# EasyEDA Pro project ProPrj_RPI5 tinkling_2026-08-20.epro

# Schematic Schematic1
Board Name: Board1; Create Date: 2026-06-21; Page Name: P1; Project Name: RPI5 tinkling; Schematic Name: Schematic1; Update Date: 2026-07-21; Company: EasyEDA.com; Page Size: A4; Version: V1.0
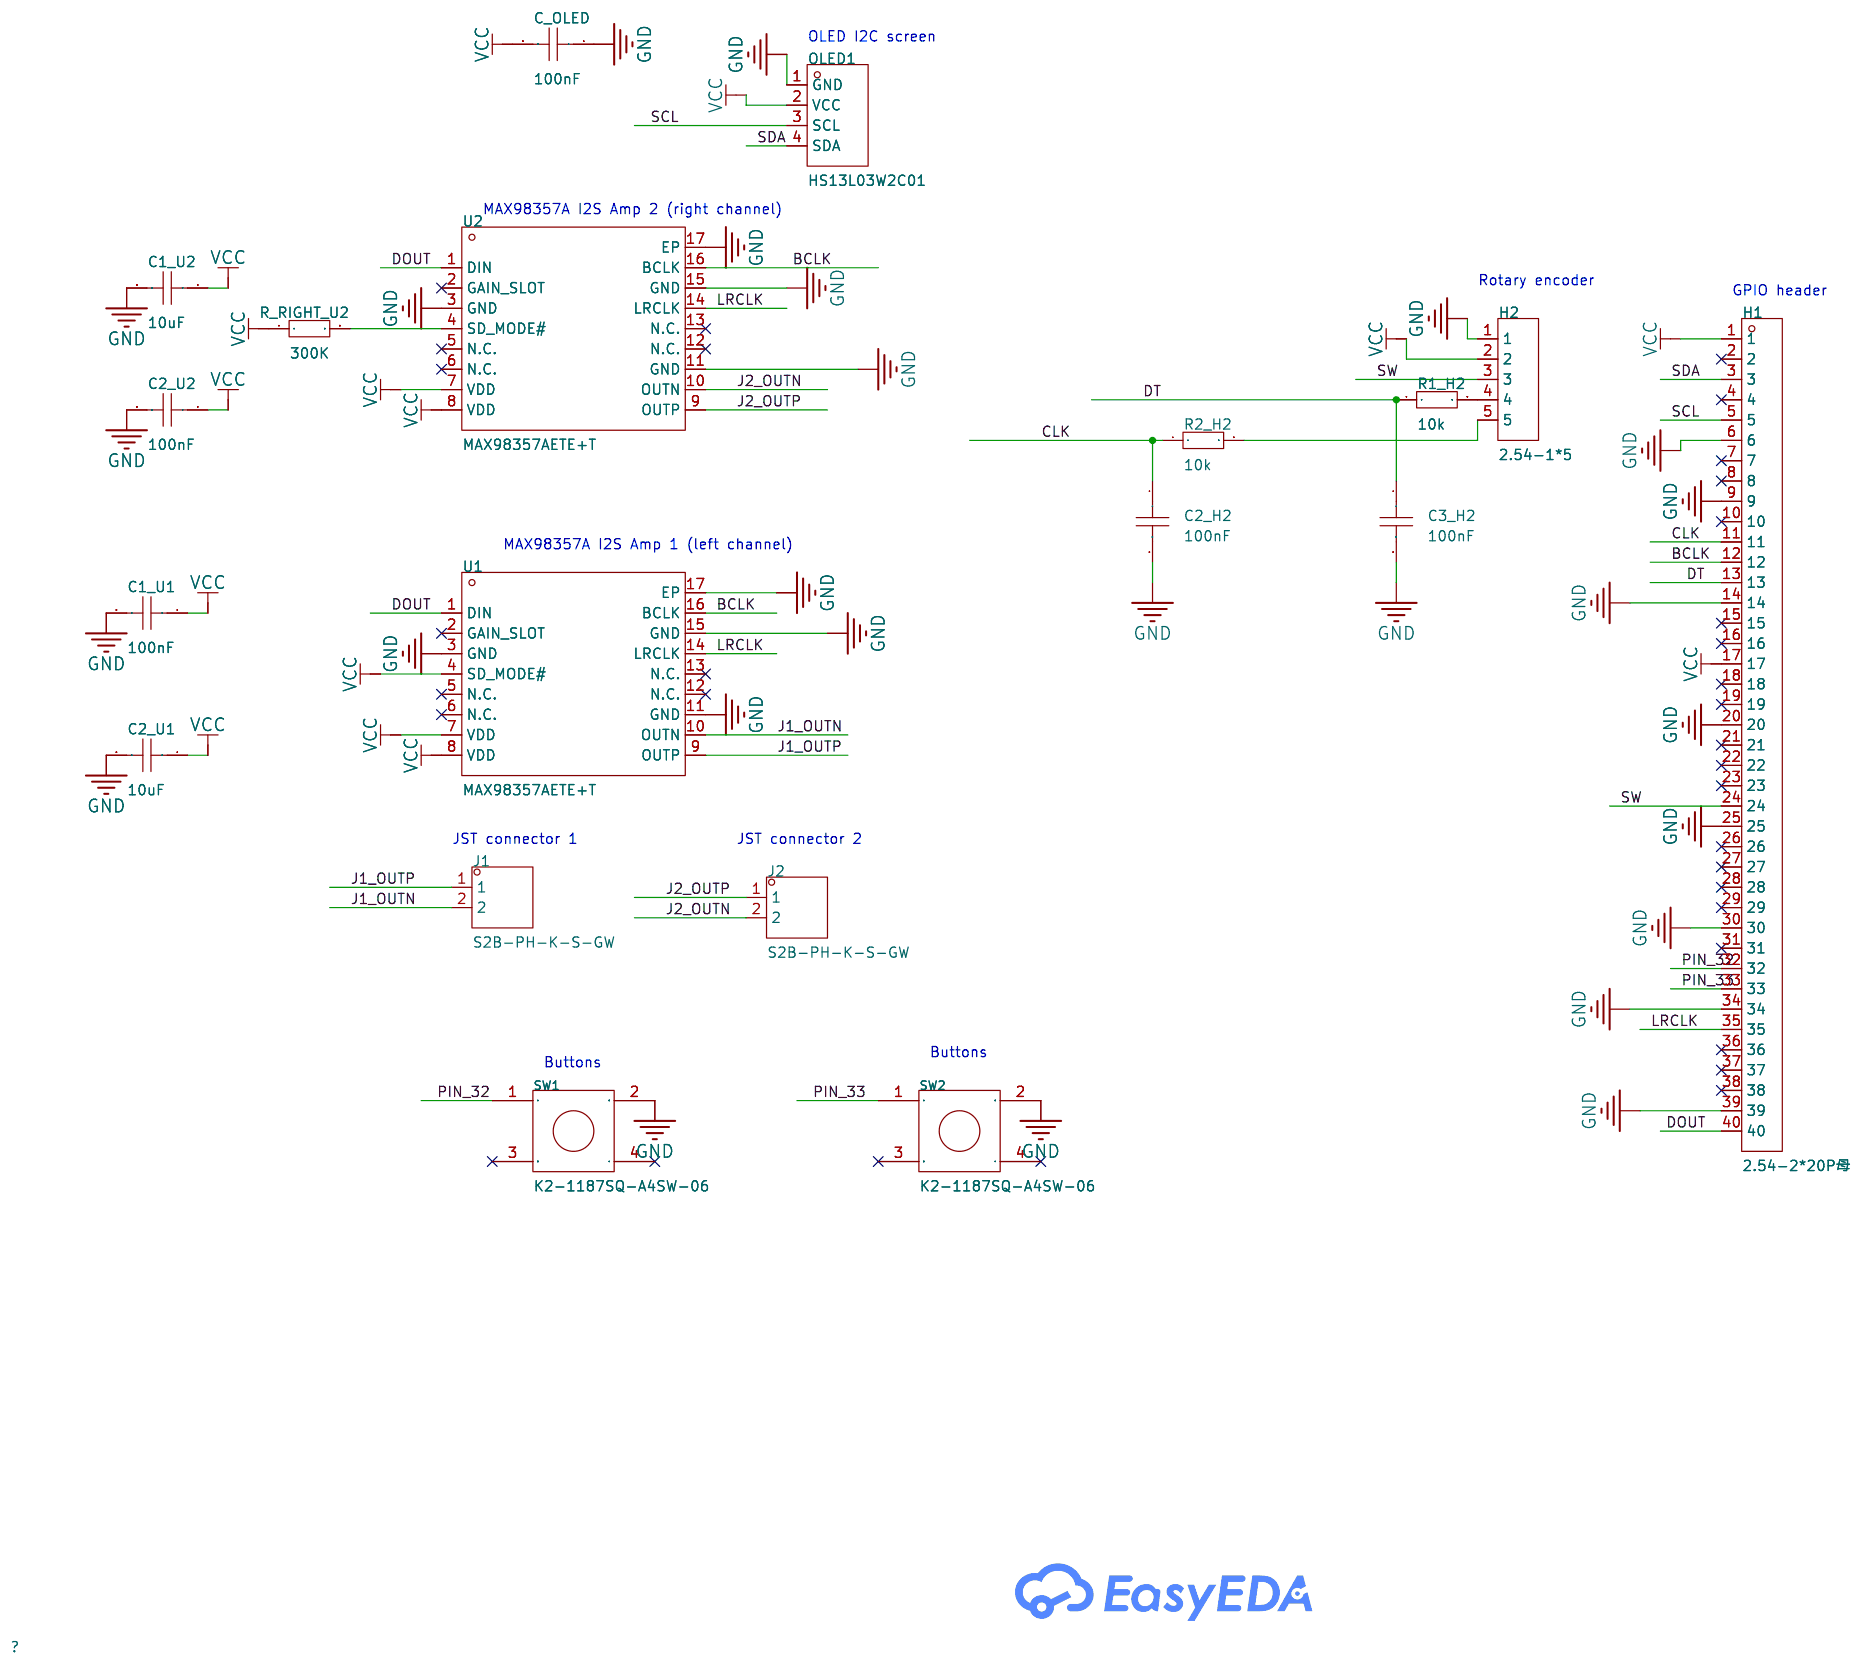
[diagram p0: schematic sheet]

## Parts
C1_U1  100nF  [C0402]
C1_U2  10uF  [C0805]
C2_H2  100nF  [C0603]
C2_U1  10uF  [C0805]
C2_U2  100nF  [C0402]
C3_H2  100nF  [C0603]
C_OLED  100nF  [C0603]
H1  2.54-2*20P母  [HDR-TH_40P-P2.54-V-F-R2-C20-S2.54]  (no BOM)
H2  2.54-1*5  [HDR-TH_5P-P2.54-V-M]  (no BOM)
J1  S2B-PH-K-S-GW  [CONN-TH_S2B-PH-K-S-GW]
J2  S2B-PH-K-S-GW  [CONN-TH_S2B-PH-K-S-GW]
OLED1  HS13L03W2C01  [OLED-TH_L35.4-W33.5_HS13L03W2C01]  (no BOM)
R1_H2  10k  [R0603]
R2_H2  10k  [R0603]
R_RIGHT_U2  300K  [R0603]
SW1  K2-1187SQ-A4SW-06  [KEY-SMD_4P-L5.2-W5.2-P3.70-LS6.4]
SW2  K2-1187SQ-A4SW-06  [KEY-SMD_4P-L5.2-W5.2-P3.70-LS6.4]
U1  MAX98357AETE+T  [TQFN-16_L3.0-W3.0-P0.50-BL-EP1.5]
U2  MAX98357AETE+T  [TQFN-16_L3.0-W3.0-P0.50-BL-EP1.5]

## Library data of the parts
C1_U1 C2_U2 = CL05B104KO5NNNC: Capacitance:100nF Tolerance:±10% Tolerance:±10% Voltage Rating:16V Temperature Coefficient:X7R; LCSC Part Name: 100nF ±10% 16V; Supplier Part: C1525; Manufacturer: SAMSUNG(三星); Supplier Footprint: 0402; JLCPCB Part Class: Basic Part; Datasheet: https://item.szlcsc.com/datasheet/CL05B104KO5NNNC/1877.html; Supplier: LCSC; Tolerance: ±10%; Voltage Rating: 16V; Temperature Coefficient: X7R
C1_U2 C2_U1 = CL21A106KAYNNNE_C15850: Capacitance:10uF Tolerance:±10% Tolerance:±10% Voltage Rating:25V Temperature Coefficient:X5R; LCSC Part Name: 10uF ±10% 25V; Supplier Part: C15850; Manufacturer: SAMSUNG(三星); Manufacturer Part: CL21A106KAYNNNE; Supplier Footprint: 0805; JLCPCB Part Class: Basic Part; Datasheet: https://item.szlcsc.com/datasheet/CL21A106KAYNNNE/16532.html; Supplier: LCSC; Tolerance: ±10%; Voltage Rating: 25V; Temperature Coefficient: X5R
C2_H2 C3_H2 C_OLED = CL10B104KA8NNNC: Capacitance:100nF Tolerance:±10% Tolerance:±10% Voltage Rating:25V Temperature Coefficient:X7R; LCSC Part Name: 100nF ±10% 25V; Supplier Part: C1590; Manufacturer: SAMSUNG(三星); Supplier Footprint: 0603; JLCPCB Part Class: Extended Part; Datasheet: https://item.szlcsc.com/datasheet/CL10B104KA8NNNC/1942.html; Supplier: LCSC; Tolerance: ±10%; Voltage Rating: 25V; Temperature Coefficient: X7R
H1 = 2.54-2*20P母: Holes Structure:2x20P Pitch:2.54mm Row Spacing:2.54mm Circular Hole / Square Hole:Square Hole Mounting Type:Through Hole Number of Rows:2 Number of Positions:40P Holes Direction:Top Insulation Height:- Contact Material:Brass Contact Plating:-; LCSC Part Name: 2x20P 间距:2.54mm 直插; Supplier Part: C50982; Manufacturer: BOOMELE(博穆精密); Supplier Footprint: 插件,P=2.54mm; JLCPCB Part Class: Extended Part; Supplier: LCSC; Holes Structure: 2x20P; Pitch: 2.54mm; Row Spacing: 2.54mm; Circular Hole / Square Hole: Square Hole; Mounting Type: Through Hole; Number of Rows: 2; Number of Positions: 40P; Holes Direction: Top; Contact Material: Brass
H2 = 2.54-1*5: Pin Structure:1x5P Pitch:2.54mm Circluar Pins/Square Pins:Pin Header Mounting Type:Through Hole Number of Rows:1 Number of Pins:5P Current Rating:2.5A Length of Mating Pin:6mm Insulation Height:2.54mm Length of End Connection Pin:3mm Contact Material:Bras; LCSC Part Name: 1x5P 间距:2.54mm 方针 直插; Supplier Part: C5156614; Manufacturer: ZHOURI(洲日); Supplier Footprint: 插件,P=2.54mm; JLCPCB Part Class: Extended Part; Datasheet: https://item.szlcsc.com/datasheet/2.54-1*5/5790714.html; Supplier: LCSC; Pin Structure: 1x5P; Pitch: 2.54mm; Circluar Pins/Square Pins: Pin Header; Mounting Type: Through Hole; Number of Rows: 1; Number of Pins: 5P; Current Rating: 2.5A; Length of Mating Pin: 6mm; Insulation Height: 2.54mm; Length of End Connection Pin: 3mm; Contact Material: Brass; Contact Plating: Gold; Operating Temperature: -40℃~+105℃
J1 J2 = S2B-PH-K-S-GW: Pins Structure:1x2P Pitch:2mm Mounting Type:Right Angle Reference Series:PH Number of Pins:2P Number of Rows:1 Number of PINs Per Row:2 Row Spacing:- Current Rating:2A Contact Material:Brass Contact Plating:Tin Operating Temperature:-25℃~+85℃ Operating Te; LCSC Part Name: 1x2P 间距:2mm 弯插 系列:PH; Supplier Part: C157932; Manufacturer: JST; Supplier Footprint: 弯插,P=2mm; JLCPCB Part Class: Extended Part; Datasheet: https://item.szlcsc.com/datasheet/S2B-PH-K-S-GW/169280.html; Supplier: LCSC; Pins Structure: 1x2P; Pitch: 2mm; Mounting Type: Right Angle; Reference Series: PH; Number of Pins: 2P; Number of Rows: 1; Number of PINs Per Row: 2; Current Rating: 2A; Contact Material: Brass; Contact Plating: Tin; Operating Temperature: -25℃~+85℃; Voltage Rating: 100V; Plastic Material: PA66; Flame Retardant Rating: UL94V-0; Supplementary Features: K Pin; Color: White; Z-Height of the Board: 4.8mm; X-Length of Bottom Edge on Board (Spacing Line): 5.9mm; Y-Width of Bottom Edge on Board: 7.6mm
OLED1 = HS13L03W2C01: Main Control Chip:SH1106 Interface Type:I2C Size:1.3 Operating Temperature:-40℃~+70℃ Operating Temperature:-40℃~+70℃; LCSC Part Name: 1.3'1.3寸 128*64 OLED显示屏 I2C通讯 SH1106 白光; Supplier Part: C7465997; Manufacturer: HS(汉昇); JLCPCB Part Class: Extended Part; Datasheet: https://atta.szlcsc.com/upload/public/pdf/source/20230720/8731A47396DED074CDCD72E9ACEFB46F.pdf; Supplier: LCSC; Main Control Chip: SH1106; Interface Type: I2C; Size: 1.3; Operating Temperature: -40℃~+70℃
R1_H2 R2_H2 R_RIGHT_U2 = Res_0603: Supplier Footprint: 0603
SW1 SW2 = K2-1187SQ-A4SW-06: Circuit:SPST Actuator Style:Round Button Operating Force:2.5N Mounting Type:Surface Mount,Vertical Length:5.2mm Width:5.2mm Switch Height:1.5mm Contact Current:50mA Voltage Rating:12V With Lamp:- Life:100,000 Cycles Operating Temperature:-25℃~+85℃ Operati; LCSC Part Name: 轻触开关 5.2*5.2*1.5  250gf  铜头; Supplier Part: C92584; Manufacturer: 韩国韩荣; Supplier Footprint: SMD; JLCPCB Part Class: Extended Part; Datasheet: https://item.szlcsc.com/datasheet/K2-1187SQ-A4SW-06/93777.html; Supplier: LCSC; Circuit: SPST; Actuator Style: Round Button; Operating Force: 2.5N; Mounting Type: Surface Mount,Vertical; Length: 5.2mm; Width: 5.2mm; Switch Height: 1.5mm; Contact Current: 50mA; Voltage Rating: 12V; Life: 100,000 Cycles; Operating Temperature: -25℃~+85℃
U1 U2 = MAX98357AETE+T: Class:Class D Speaker Channels:- Output Power:3.2W×1@4Ω Voltage - Supply:2.5V~5.5V Voltage - Supply:2.5V~5.5V Total Harmonic Distortion + Noise (THD+N):- Quiescent Current:2.4mA Operating Temperature:-40℃~+85℃ Operating Temperature:-40℃~+85℃ Power Supply; LCSC Part Name: 微型、低成本、PCM 类 D 级放大器具有 AB 级性能; Supplier Part: C910544; Manufacturer: ADI(亚德诺)/MAXIM(美信); Supplier Footprint: TQFN-16-EP(3x3); JLCPCB Part Class: Extended Part; Datasheet: https://item.szlcsc.com/datasheet/MAX98357AETE%252BT/978950.html; Supplier: LCSC; Class: Class D; Output Power: 3.2W×1@4Ω; Voltage - Supply: 2.5V~5.5V; Quiescent Current: 2.4mA; Operating Temperature: -40℃~+85℃; Power Supply Rejection Ratio (PSRR): 77dB; Efficiency: 92%

## Nets
GND: C1_U1.2 C1_U2.2 C2_H2.2 C2_U1.2 C2_U2.2 C3_H2.2 C_OLED.1 H1.6 H1.9 H1.14 H1.20 H1.25 H1.30 H1.34 H1.39 H2.1 OLED1.1(GND) SW1.2 SW2.2 U1.3(GND) U1.11(GND) U1.15(GND) U1.17(EP) U2.3(GND) U2.11(GND) U2.15(GND) U2.17(EP)
VCC: C1_U1.1 C1_U2.1 C2_U1.1 C2_U2.1 C_OLED.2 H1.1 H1.17 H2.2 OLED1.2(VCC) R_RIGHT_U2.1 U1.4(SD_MODE#) U1.7(VDD) U1.8(VDD) U2.7(VDD) U2.8(VDD)
BCLK: H1.12 U1.16(BCLK) U2.16(BCLK)
CLK: C2_H2.1 H1.11 R2_H2.1
DOUT: H1.40 U1.1(DIN) U2.1(DIN)
DT: C3_H2.1 H1.13 R1_H2.1
J1_OUTN: J1.2 U1.10(OUTN)
J1_OUTP: J1.1 U1.9(OUTP)
J2_OUTN: J2.2 U2.10(OUTN)
J2_OUTP: J2.1 U2.9(OUTP)
LRCLK: H1.35 U1.14(LRCLK) U2.14(LRCLK)
PIN_32: H1.32 SW1.1
PIN_33: H1.33 SW2.1
SCL: H1.5 OLED1.3(SCL)
SDA: H1.3 OLED1.4(SDA)
SW: H1.24 H2.3
$1N7016: H2.4 R1_H2.2
$1N7184: H2.5 R2_H2.2
Net-(R_RIGHT_U2-2): R_RIGHT_U2.2 U2.4(SD_MODE#)

Not connected (* = marked no-connect by the designer): H1 2* 4* 7* 8* 10* 15* 16* 18* 19* 21* 22* 23* 26* 27* 28* 29* 31* 36* 37* 38*; SW1 3* 4*; SW2 3* 4*; U1 2(GAIN_SLOT)* 5(N.C.)* 6(N.C.)* 12(N.C.)* 13(N.C.)*; U2 2(GAIN_SLOT)* 5(N.C.)* 6(N.C.)* 12(N.C.)* 13(N.C.)*

## Notes on the sheet
- OLED I2C screen
- MAX98357A I2S Amp 2 (right channel)
- Rotary encoder
- GPIO header
- MAX98357A I2S Amp 1 (left channel)
- JST connector 1
- JST connector 2
- Buttons
- Buttons

# Board PCB1
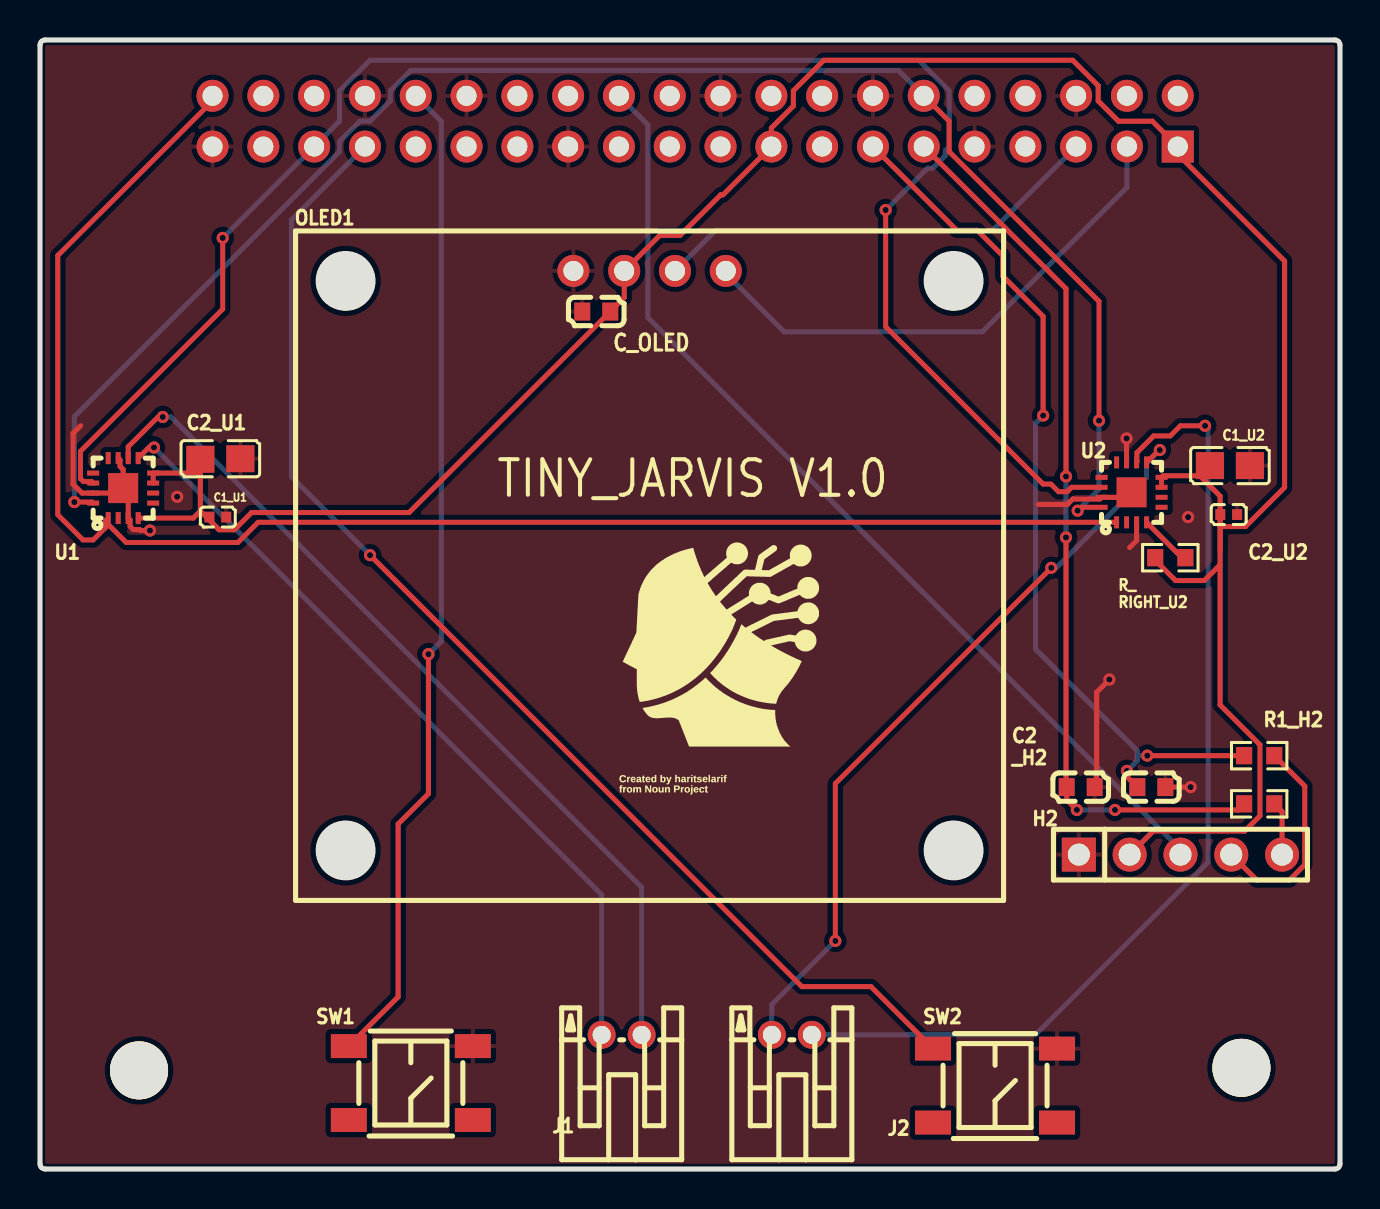
[diagram p1: board, top side]
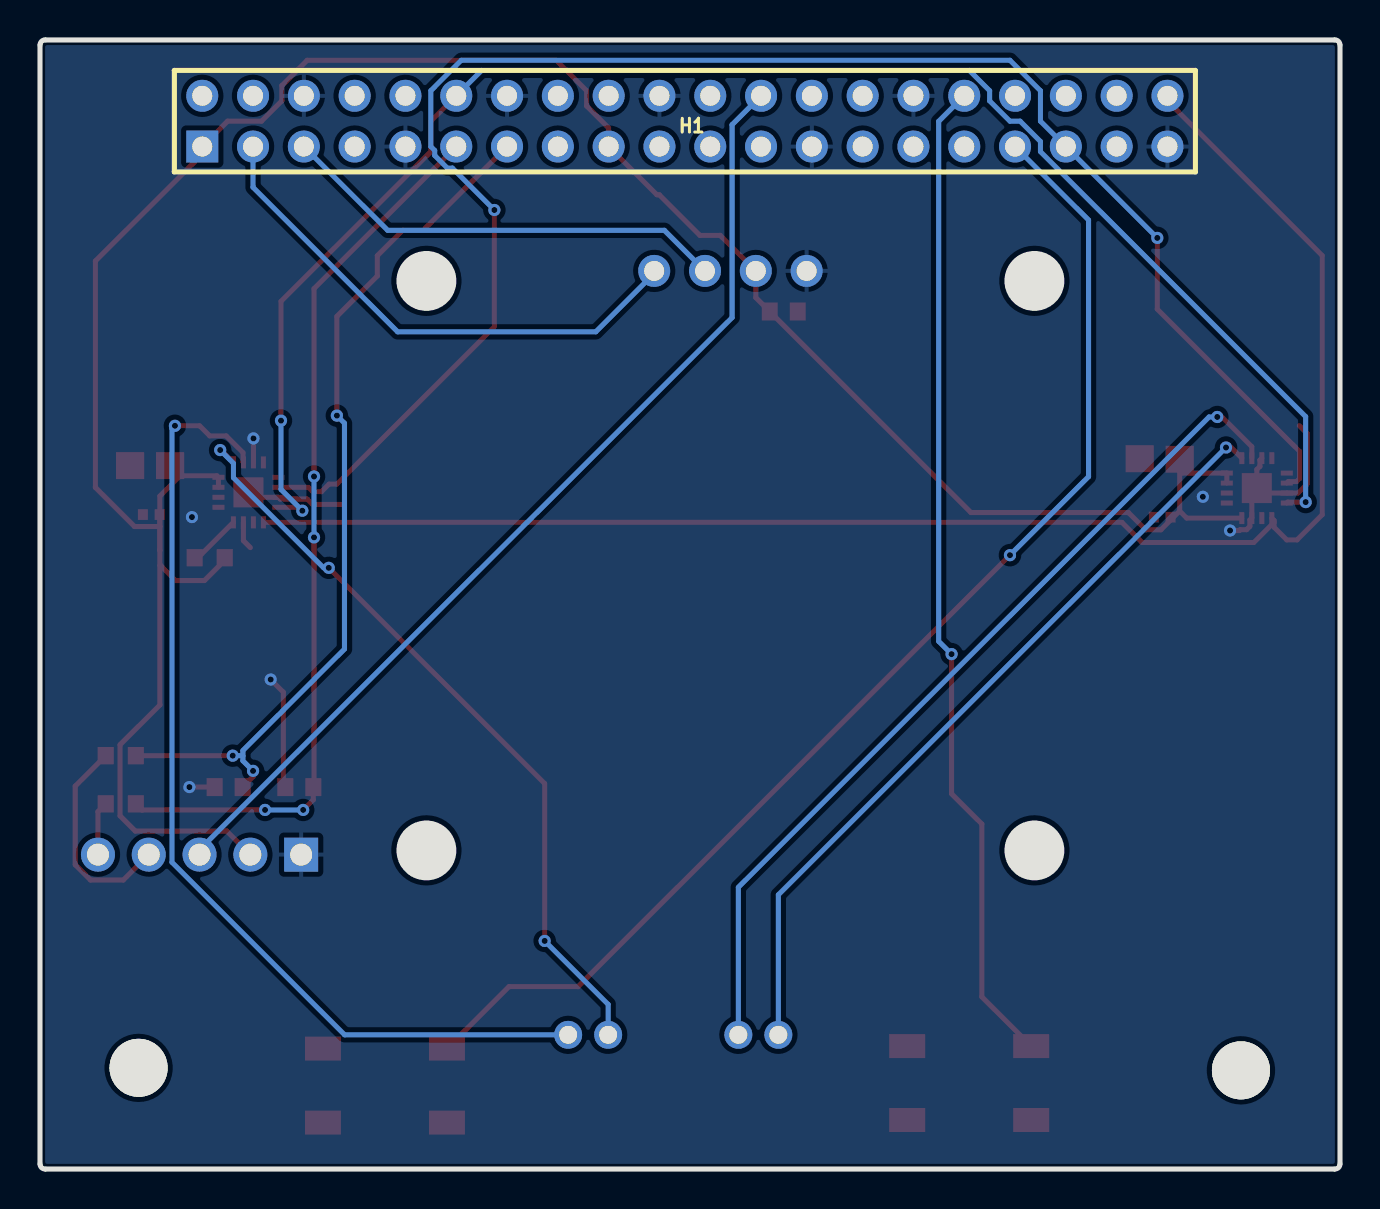
[diagram p2: board, bottom side, seen from below]

Outline 65 x 56.5 mm; copper layers: Top Layer, Bottom Layer. Coordinates in mm from the lower left corner of the outline.
Outline path: 0,56.25 0,0.25 arc(0.07,0.07) 0.25,0 64.75,0 arc(64.93,0.07) 65,0.25 65,56.25 arc(64.93,56.43) 64.75,56.5 0.25,56.5 arc(0.07,56.43) 0,56.25
Stack: Top Layer 0.035mm / Dielectric1 1.51mm FR4 er 4.5 / Bottom Layer 0.035mm

## Design rules (mm)
template: Custom Config
spacing copperThickness1oz (default): track to track 0.102, other pairs 0.152 to 0.3
spacing copperThickness2oz: track to track 0.203, other pairs 0.152 to 0.3
track width copperThickness1oz (default): min 0.127, default 0.254, max 2.54
track width copperThickness2oz: min 0.203, default 0.254, max 2.54
differential pair differentialPair (default): width min 0.127, default 0.254, max 2.54; gap min 0.152, default 0.152
via viaSize (default): diameter min 0.5, default 0.61, max 10; hole min 0.3, default 0.305, max 6.3

## Placement (name value [footprint] x y rotation side)
C1_U1  100nF  [C0402]  8.89 32.62 0 top
C1_U2  10uF  [C0805]  59.5 35.2 0 top
C2
_H2  -  [C0603]  52.03 19.11 0 top
C2_U1  10uF  [C0805]  9.02 35.54 0 top
C2_U2  100nF  [C0402]  59.44 32.75 0 top
C3_H2  100nF  [C0603]  55.57 19.11 0 top
C_OLED  100nF  [C0603]  27.81 42.91 0 top
H1  2.54-2*20P母  [HDR-TH_40P-P2.54-V-F-R2-C20-S2.54]  32.76 52.44 180 bottom
H2  2.54-1*5  [HDR-TH_5P-P2.54-V-M]  57.02 15.73 0 top
J1  S2B-PH-K-S-GW  [CONN-TH_S2B-PH-K-S-GW]  29.08 6.72 180 top
J2  S2B-PH-K-S-GW  [CONN-TH_S2B-PH-K-S-GW]  37.59 6.72 180 top
NOREF  -  [Pad_e1103]  60.07 5.06 0 top
NOREF#2  -  [Pad_e1098]  4.95 4.94 0 top
OLED1  HS13L03W2C01  [OLED-TH_L35.4-W33.5_HS13L03W2C01]  30.48 44.94 0 top
R1_H2  10k  [R0603]  60.96 20.69 0 top
R2_H2  10k  [R0603]  60.96 18.27 0 top
R_
RIGHT_U2  -  [R0603]  56.52 30.59 0 top
SW1  K2-1187SQ-A4SW-06  [KEY-SMD_4P-L5.2-W5.2-P3.70-LS6.4]  18.54 4.3 0 top
SW2  K2-1187SQ-A4SW-06  [KEY-SMD_4P-L5.2-W5.2-P3.70-LS6.4]  47.75 4.18 0 top
U1  MAX98357AETE+T  [TQFN-16_L3.0-W3.0-P0.50-BL-EP1.5]  4.16 34.07 0 top
U2  MAX98357AETE+T  [TQFN-16_L3.0-W3.0-P0.50-BL-EP1.5]  54.58 33.86 0 top

## Footprints (pads in the part's own frame, mm; a bottom-side part is the same pattern mirrored in y, then rotated)
C0402
  rect 0.5x0.54 smd: 1(-0.42,0) 2(0.42,0)
C0603
  rect 0.8x0.9 smd: 1(-0.7,0) 2(0.7,0)
C0805
  rect 1.41x1.35 smd: 1(-1,-0.025) 2(1,0)
CONN-TH_S2B-PH-K-S-GW
  round 1.4 hole 0.9: 1(1,0) 2(-1,0)
HDR-TH_5P-P2.54-V-M
  rect 1.7x1.7 hole 1.1: 1(-5.08,0)
  round 1.7 hole 1.1: 2(-2.54,0) 3(0,0) 4(2.54,0) 5(5.08,0)
HDR-TH_40P-P2.54-V-F-R2-C20-S2.54
  rect 1.6x1.6 hole 1: 1(-24.13,-1.27)
  round 1.6 hole 1: 2(-24.13,1.27) 3(-21.59,-1.27) 4(-21.59,1.27) 5(-19.05,-1.27) 6(-19.05,1.27) 7(-16.51,-1.27) 8(-16.51,1.27) 9(-13.97,-1.27) 10(-13.97,1.27) 11(-11.43,-1.27) 12(-11.43,1.27) 13(-8.89,-1.27) 14(-8.89,1.27) 15(-6.35,-1.27) 16(-6.35,1.27) 17(-3.81,-1.27) 18(-3.81,1.27) 19(-1.27,-1.27) 20(-1.27,1.27) 21(1.27,-1.27) 22(1.27,1.27) 23(3.81,-1.27) 24(3.81,1.27) 25(6.35,-1.27) 26(6.35,1.27) 27(8.89,-1.27) 28(8.89,1.27) 29(11.43,-1.27) 30(11.43,1.27) 31(13.97,-1.27) 32(13.97,1.27) 33(16.51,-1.27) 34(16.51,1.27) 35(19.05,-1.27) 36(19.05,1.27) 37(21.59,-1.27) 38(21.59,1.27) 39(24.13,-1.27) 40(24.13,1.27)
KEY-SMD_4P-L5.2-W5.2-P3.70-LS6.4
  rect 1.8x1.2 smd: 1(-3.1,1.85) 2(3.1,1.85) 3(-3.1,-1.85) 4(3.1,-1.85)
OLED-TH_L35.4-W33.5_HS13L03W2C01
  round 1.6 hole 1: 1(-3.81,0) 2(-1.27,0) 3(1.27,0) 4(3.81,0)
Pad_e1098
  round 2.9 hole 2.9: 1(0,0)
Pad_e1103
  round 2.9 hole 2.9: 1(0,0)
R0603
  rect 0.806x0.864 smd: 1(-0.753,0) 2(0.753,0)
TQFN-16_L3.0-W3.0-P0.50-BL-EP1.5
  rect 0.25x0.6 smd: 1(-0.749,-1.5) 2(-0.248,-1.5) 3(0.252,-1.5) 4(0.751,-1.5) 9(0.75,1.5) 10(0.25,1.5) 11(-0.25,1.5) 12(-0.749,1.5)
  rect 0.6x0.25 smd: 5(1.5,-0.748) 6(1.5,-0.248) 7(1.5,0.252) 8(1.5,0.752) 13(-1.5,0.752) 14(-1.5,0.252) 15(-1.5,-0.248) 16(-1.5,-0.748)
  rect 1.5x1.5 smd: 17(0,0)

## Nets
GND: C1_U1.2 C1_U2.2 C2
_H2.2 C2_U1.2 C2_U2.2 C3_H2.2 C_OLED.1 H1.6 H1.9 H1.14 H1.20 H1.25 H1.30 H1.34 H1.39 H2.1 OLED1.1 SW1.2 SW2.2 U1.3 U1.11 U1.15 U1.17 U2.3 U2.11 U2.15 U2.17
VCC: C1_U1.1 C1_U2.1 C2_U1.1 C2_U2.1 C_OLED.2 H1.1 H1.17 H2.2 OLED1.2 R_
RIGHT_U2.1 U1.4 U1.7 U1.8 U2.7 U2.8
BCLK: H1.12 U1.16 U2.16
CLK: C2
_H2.1 H1.11 R2_H2.1
DOUT: H1.40 U1.1 U2.1
DT: C3_H2.1 H1.13 R1_H2.1
J1_OUTN: J1.2 U1.10
J1_OUTP: J1.1 U1.9
J2_OUTN: J2.2 U2.10
J2_OUTP: J2.1 U2.9
LRCLK: H1.35 U1.14 U2.14
PIN_32: H1.32 SW1.1
PIN_33: H1.33 SW2.1
SCL: H1.5 OLED1.3
SDA: H1.3 OLED1.4
SW: H1.24 H2.3
$1N2115: R_
RIGHT_U2.2 U2.4
$1N7016: H2.4 R1_H2.2
$1N7184: H2.5 R2_H2.2

Pads without a net: H1 2 4 7 8 10 15 16 18 19 21 22 23 26 27 28 29 31 36 37 38; NOREF 1; NOREF#2 1; SW1 3 4; SW2 3 4; U1 2 5 6 12 13; U2 2 5 6 12 13

## Via types
v1: diameter 0.61, hole 0.305, Top Layer to Bottom Layer, 26 vias

## Routing (per net, layer and track width the routed paths; a pad name or vN(x,y) marks a point on that pad's centre or on a via; arc(x,y) is an arc through that point)
GND: length 25.1
  Top Layer w0.254: U1.17 4.41,33.82 4.41,32.57 4.51,32.48 4.51,32.16 4.67,32 4.99,32 5.03,31.95 v1(5.5,31.95) ; U1.17 4.16,35 4,35.16 4,35.48 U1.11 ; U1.17 3.91,33.83 U1.15 2.1,33.83 1.65,34.27 1.65,36.81 2.03,37.2 ; v1(53.47,24.5) 52.83,23.86 52.83,19.21 C2
_H2.2 ; 54.48,31.1 54.83,31.45 U2.3 ; U2.17 54.33,33.61 U2.15 52.99,33.53 51.64,33.53 51.37,33.26 49.91,33.26 ; U2.11 v1(54.33,36.56) ; 56.27,19.11 v1(57.53,19.11)
  vias: v1(6.86,33.64) v1(57.4,32.62)
VCC: length 130
  Top Layer w0.25: U1.7 U1.8 7.88,34.83 8.02,34.96 ; 8.02,32.93 7.67,32.57 U1.4 ; U2.7 U2.8 56.16,34.69 57.99,34.69 C1_U2.1 ; 59.01,30.96 59.02,30.97 C2_U2.1
  Top Layer w0.254: 59.01,30.2 58.97,30.2 58.21,29.45 56.78,29.45 55.76,30.46 R_
RIGHT_U2.1 ; 59.01,30.2 59.01,23.22 61,21.23 61,17.67 60.23,16.91 55.66,16.91 H2.2 ; 59.01,30.2 59.01,32.15 ; 8.45,32.5 C1_U1.1 ; 8.45,32.5 8.95,31.99 9.72,31.99 10.58,32.85 18.45,32.85 C_OLED.2 29.21,43.61 OLED1.2 30.99,46.72 32,46.72 34.04,48.75 34.15,48.75 H1.17 36.57,52.1 37.67,53.2 37.67,53.96 39.19,55.48 51.64,55.48 52.91,54.21 52.91,53.45 53.92,52.44 55.62,52.44 56.97,51.08 56.97,50.69 62.23,45.44 62.23,34.11 60.27,32.15 59.01,32.15 ; 8.45,32.5 8.02,32.93 C2_U1.1 ; 59.01,32.91 59.01,32.15 ; 59.01,32.91 C2_U2.1 ; 59.01,32.91 59.01,33.68 57.99,34.69
BCLK: length 81.8
  Top Layer w0.25: 52.75,33.11 52.05,33.11 v1(51.88,32.94) ; v1(52.95,37.45) 52.95,43.42 45.46,50.91 45.46,52.44 H1.12 ; U1.16 2.61,33.38 v1(1.72,33.38)
  Bottom Layer w0.25: v1(51.88,32.94) 52.95,34.01 v1(52.95,37.45) ; H1.12 42.92,54.98 18.53,54.98 17.52,53.96 17.52,53.45 16.5,52.44 15.99,52.44 14.98,51.42 14.98,50.91 1.72,37.65 v1(1.72,33.38)
CLK: length 44.9
  Top Layer w0.254: v1(51.3,34.66) 51.3,44.05 H1.11 ; v1(53.75,17.97) 59.9,17.97 R2_H2.1 ; v1(51.3,31.61) 51.3,19.15 C2
_H2.1 51.33,18.48 v1(51.84,17.97)
  Bottom Layer w0.254: v1(51.84,17.97) v1(53.75,17.97) ; v1(51.3,34.66) v1(51.3,31.61)
DOUT: length 79.2
  Top Layer w0.25: 3.41,32.57 3.29,32.46 3.29,32.37 ; H1.40 8.63,53.45 0.89,45.71 0.89,32.74 2.15,31.48 2.66,31.48 3.29,32.12 3.29,32.37 ; 3.29,32.37 4.31,31.35 9.9,31.35 10.91,32.36 U2.1
DT: length 44.2
  Top Layer w0.254: v1(50.16,37.7) 50.16,42.67 48.13,44.69 48.13,45.7 46.86,46.97 45.84,46.97 H1.13 ; C3_H2.1 54.35,19.63 v1(54.35,19.92) ; v1(55.36,20.69) R1_H2.1
  Bottom Layer w0.254: v1(50.16,37.7) 49.78,37.32 49.78,26.02 54.86,20.94 54.86,20.69 ; 54.86,20.69 54.86,20.43 v1(54.35,19.92) ; 54.86,20.69 v1(55.36,20.69)
J1_OUTN: length 44
  Top Layer w0.25: U1.10 4.41,36.14 5.9,37.63 v1(6.14,37.63)
  Bottom Layer w0.25: v1(6.14,37.63) 6.55,37.63 30.08,14.1 J1.2
J1_OUTP: length 39.7
  Top Layer w0.25: U1.9 5.44,36.11 v1(5.7,36.11)
  Bottom Layer w0.25: v1(5.7,36.11) 28.08,13.72 J1.1
J2_OUTN: length 49.7
  Top Layer w0.25: 54.83,35.36 54.85,35.38 54.85,35.85 55.69,36.69 56.52,36.69 57.02,37.19 v1(58.25,37.19)
  Bottom Layer w0.25: v1(58.25,37.19) 58.4,37.04 58.4,15.35 49.77,6.72 J2.2
J2_OUTP: length 38.4
  Top Layer w0.25: v1(55.99,35.98) 55.95,35.98 55.33,35.36 ; v1(39.77,11.41) 39.77,19.29 v1(50.56,30.08)
  Bottom Layer w0.25: v1(50.56,30.08) 50.82,30.08 55.33,34.6 55.33,35.32 v1(55.99,35.98) ; v1(39.77,11.41) 36.59,8.24 J2.1
LRCLK: length 84.8
  Top Layer w0.25: v1(42.28,47.99) 42.28,42.15 50.16,34.27 50.55,34.27 50.93,33.89 51.36,33.89 51.58,34.11 U2.14 ; v1(9.14,46.59) 9.14,43.03 2.02,35.92 2.02,34.55 2.17,34.4 2.58,34.4 U1.14
  Bottom Layer w0.25: v1(9.14,46.59) H1.35 14.98,52.44 14.98,53.96 16.5,55.48 43.93,55.48 45.46,53.96 45.46,51.17 45.26,50.97 45.26,50.72 44.63,50.09 44.38,50.09 v1(42.28,47.99)
PIN_32: length 50
  Top Layer w0.254: 15.44,6.15 17.91,8.62 17.91,17.27 19.42,18.78 v1(19.42,25.77)
  Bottom Layer w0.254: H1.32 20.07,52.43 20.07,26.41 v1(19.42,25.77)
PIN_33: length 62
  Top Layer w0.254: SW2.1 41.55,9.13 38.09,9.13 v1(16.5,30.72)
  Bottom Layer w0.254: H1.33 12.57,47.49 12.57,34.65 v1(16.5,30.72)
SCL: length 22.6
  Bottom Layer w0.254: OLED1.3 33.78,46.97 47.62,46.97 H1.5
SDA: length 26.4
  Bottom Layer w0.254: OLED1.4 34.29,44.82 37.21,41.89 47.12,41.89 54.35,49.13 H1.3
SW: length 49.6
  Bottom Layer w0.254: H1.24 30.4,52.26 30.4,42.61 57.02,15.98 H2.3
$1N2115: length 2.7
  Top Layer w0.254: R_
RIGHT_U2.2 57.1,30.59 U2.4
$1N7016: length 10.6
  Top Layer w0.254: H2.4 60.83,14.46 62.48,14.46 63.24,15.22 63.24,19.16 R1_H2.2
$1N7184: length 2.7
  Top Layer w0.254: R2_H2.2 62.1,17.88 H2.5

## Copper pours and planes (outline as drawn; the poured copper is in the pictures)
GND on Top Layer: 0.07,56.43 64.75,56.43 64.75,0 0.07,0
GND on Top Layer: 0.07,56.43 64.93,56.43 64.93,0.07 0.07,0.07
GND on Top Layer: 0.07,56.43 65,56.43 65,0.25 0.07,0.25
GND on Bottom Layer: 0.07,56.43 64.93,56.43 64.93,0.07 0.07,0.07
$1N833 on Top Layer: -0.15,56.43 64.93,56.43 64.93,0.07 -0.15,0.07

## Text on the board
Top Silkscreen Layer: C_OLED | TINY_JARVIS V1.0
